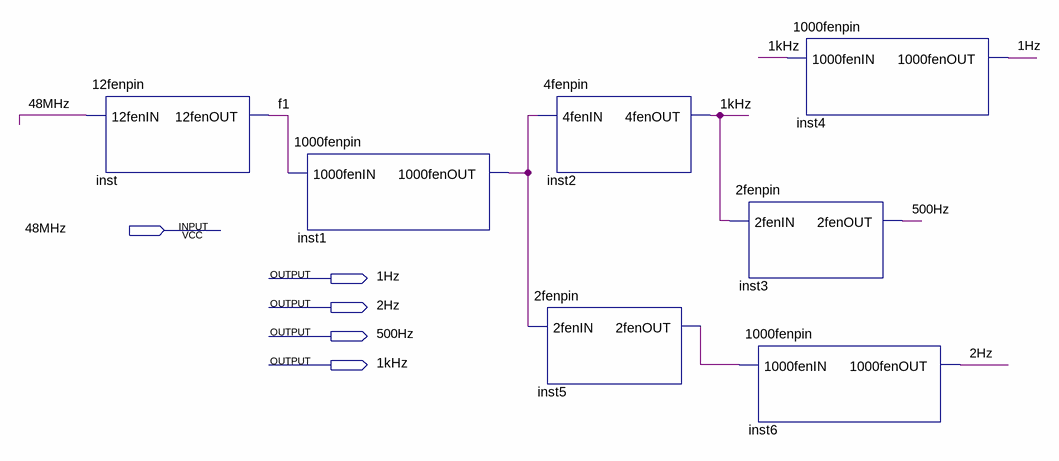
[diagram p0: schematic sheet]
// Quartus schematic fenpin2.bdf as structural Verilog: 7 symbols, 5 pins
module fenpin2 (
  input  \48MHz ,
  output \1Hz ,
  output \2Hz ,
  output \500Hz ,
  output \1kHz 
);

  wire f1, inst1_1000fenout, inst5_2fenout;

  \12fenpin  inst (.\12fenIN (\48MHz ), .\12fenOUT (f1));
  \1000fenpin  inst1 (.\1000fenIN (f1), .\1000fenOUT (inst1_1000fenout));
  \2fenpin  inst5 (.\2fenIN (inst1_1000fenout), .\2fenOUT (inst5_2fenout));
  \4fenpin  inst2 (.\4fenIN (inst1_1000fenout), .\4fenOUT (\1kHz ));
  \2fenpin  inst3 (.\2fenIN (\1kHz ), .\2fenOUT (\500Hz ));
  \1000fenpin  inst6 (.\1000fenIN (inst5_2fenout), .\1000fenOUT (\2Hz ));
  \1000fenpin  inst4 (.\1000fenIN (\1kHz ), .\1000fenOUT (\1Hz ));
endmodule
